# EAGLE design Carranco_shield (EAGLE 6.2)
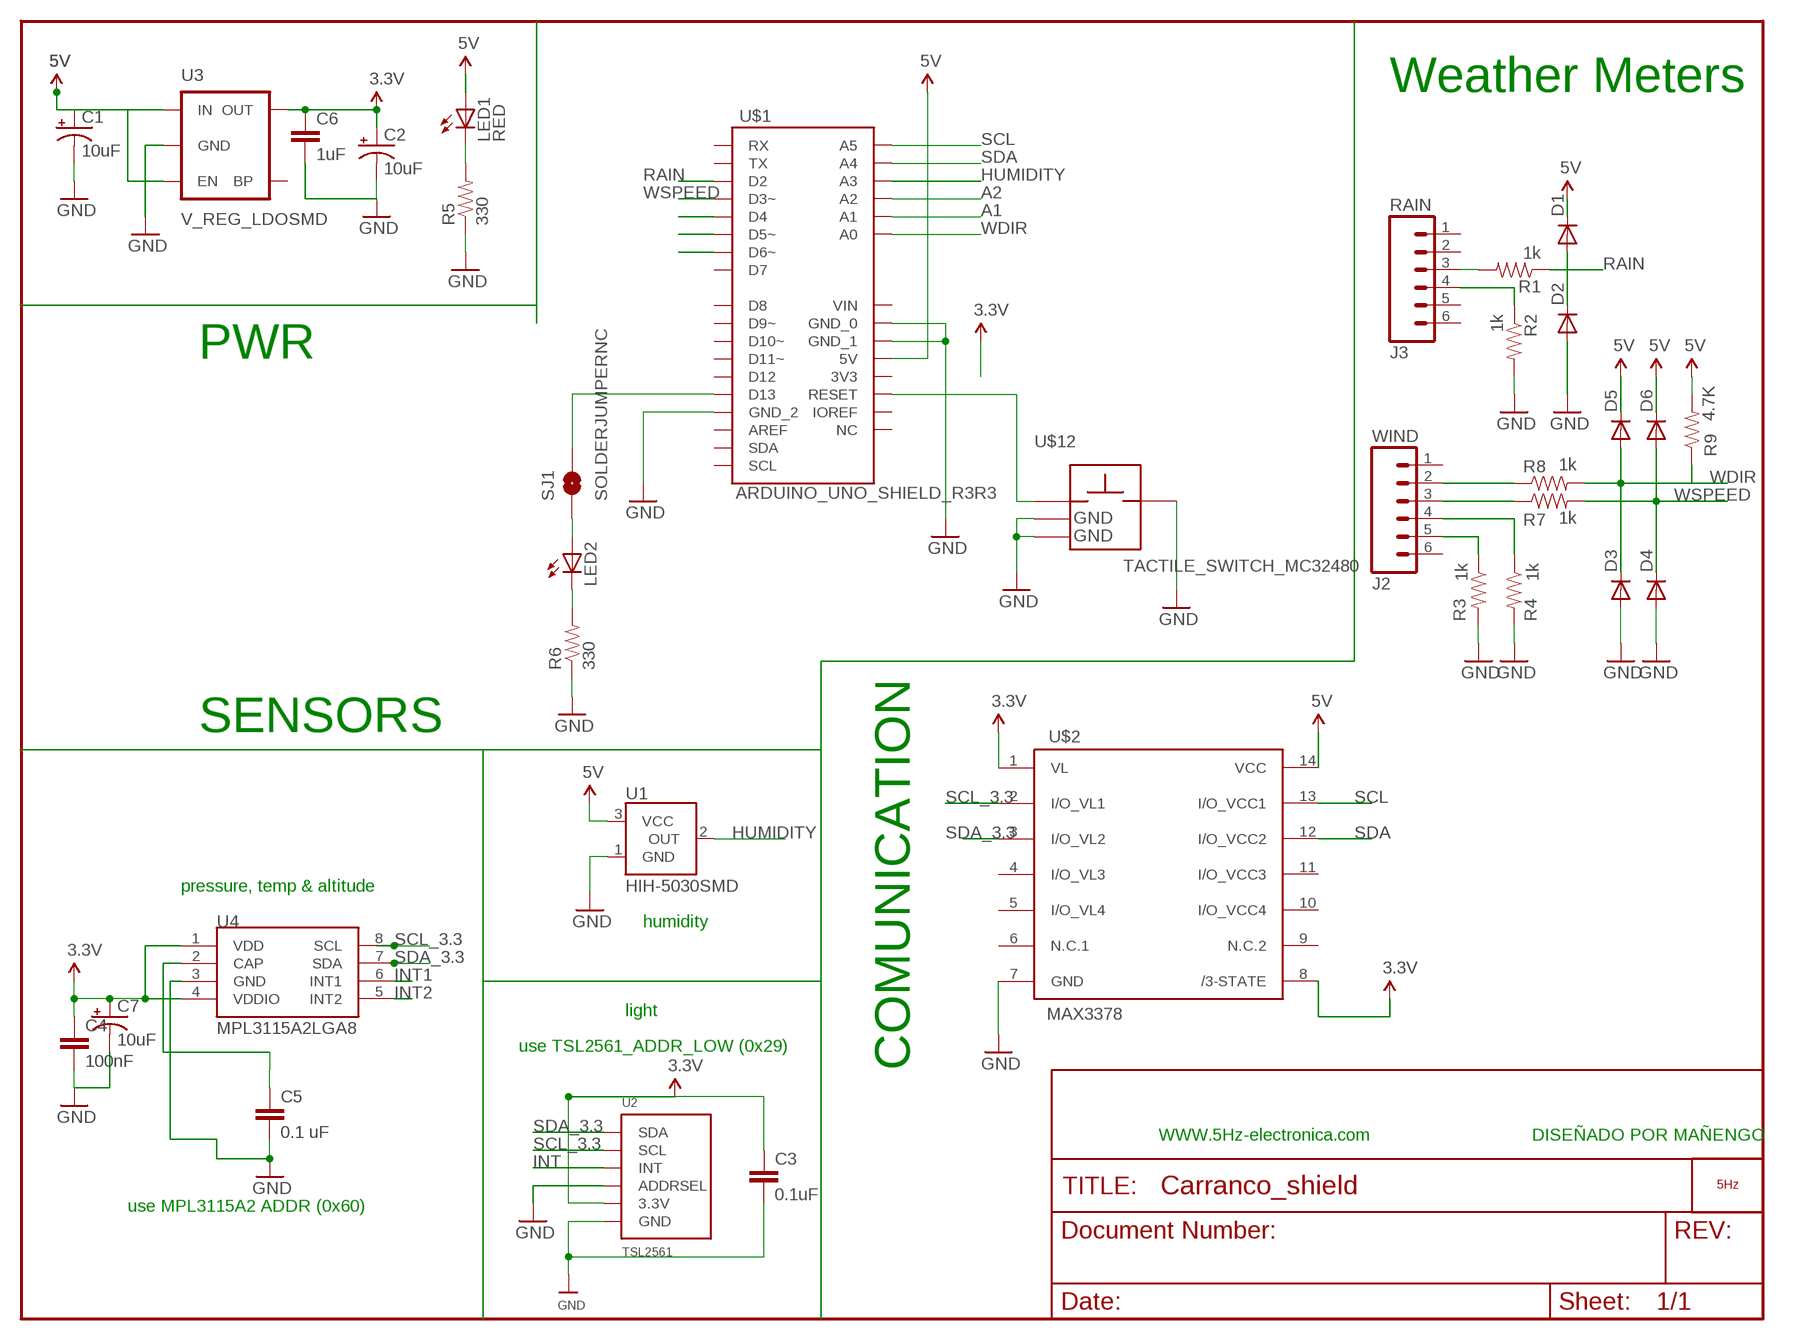
[diagram p0: schematic, sheet 1]

## Parts
C1  10uF  CAP_POL1206  [EIA3216]
C2  10uF  CAP_POL1206  [EIA3216]
C3  0.1uF  CAP0603-CAP  [0603-CAP]
C4  100nF  CAP0603-CAP  [0603-CAP]
C5  0.1 uF  CAP0603-CAP  [0603-CAP]
C6  1uF  CAP0603-CAP  [0603-CAP]
C7  10uF  CAP_POL1206  [EIA3216]
D1  DIODESOD  [SOD-323]
D2  DIODESOD  [SOD-323]
D3  DIODESOD  [SOD-323]
D4  DIODESOD  [SOD-323]
D5  DIODESOD  [SOD-323]
D6  DIODESOD  [SOD-323]
J2  WIND  RJ11-6PTH  [RJ11-6]
J3  RAIN  RJ11-6PTH  [RJ11-6]
LED1  RED  LED0603  [LED-0603]
LED2  LED0603  [LED-0603]
LOGO1  LOGO_5HZ_H_20MM  [5HZ_LOGO_H_20MM]
R1  1k  RESISTOR0603-RES  [0603-RES]
R2  1k  RESISTOR0603-RES  [0603-RES]
R3  1k  RESISTOR0603-RES  [0603-RES]
R4  1k  RESISTOR0603-RES  [0603-RES]
R5  330  RESISTOR0603-RES  [0603-RES]
R6  330  RESISTOR0603-RES  [0603-RES]
R7  1k  RESISTOR0603-RES  [0603-RES]
R8  1k  RESISTOR0603-RES  [0603-RES]
R9  4.7K  RESISTOR0603-RES  [0603-RES]
SJ1  SOLDERJUMPERNC  [SJ_2S]
U1  HIH-5030SMD  [HIH-5030]
U2  TSL2561  [TSL2561_FN]
U3  V_REG_LDOSMD  [SOT23-5]
U4  MPL3115A2LGA8  [LGA8]
U$1  ARDUINO_UNO_SHIELD_R3R3  [UNO_R3_SHIELD_HOLES_NO_SILK]
U$2  MAX3378  [TSSOP14]
U$12  TACTILE_SWITCH_MC32480  [MC32840]

## Nets
3.3V: C2.A(+) C3.1 C4.1 C6.1 C7.A(+) U2.VDD(3.3V) U3.5(OUT) U4.1(VDD) U4.4(VDDIO) U$2.1(VL) U$2.8(/3-STATE)
5V: C1.A(+) D1.1(C) D5.1(C) D6.1(C) LED1.A R9.2 U1.3(VCC) U3.1(IN) U3.3(EN) U$1.5V U$2.14(VCC)
A1: U$1.A1
A2: U$1.A2
GND: C1.C(-) C2.C(-) C3.2 C4.2 C5.2 C6.2 C7.C(-) D2.2(A) D3.2(A) D4.2(A) R2.2 R3.2 R4.2 R5.1 R6.1 U1.1(GND) U2.ADR(ADDRSEL) U2.VSS(GND) U3.2(GND) U4.3(GND) U$1.GND_0 U$1.GND_1 U$1.GND_2 U$2.7(GND) U$12.B U$12.GND@1(GND) U$12.GND@2(GND)
HUMIDITY: U1.2(OUT) U$1.A3
INT: U2.INT
INT1: U4.6(INT1)
INT2: U4.5(INT2)
N$1: U$1.RES(RESET) U$12.A@1(A)
N$2: C5.1 U4.2(CAP)
N$3: J3.3 R1.2
N$5: J3.4 R2.1
N$6: J2.5 R3.1
N$17: J2.4 R4.1
N$34: J2.3 R7.1
N$53: J2.2 R8.1
N$87: U$1.D4
N$88: U$1.D5(D5~)
N$113: U$1.D6(D6~)
N$223: LED2.C R6.2
N$224: LED2.A SJ1.1
N$241: LED1.C R5.2
N$242: SJ1.2 U$1.D13
RAIN: D1.2(A) D2.1(C) R1.1 U$1.D2
SCL: U$1.A5 U$2.13(I/O_VCC1)
SCL_3.3: U2.CLK(SCL) U4.8(SCL) U$2.2(I/O_VL1)
SDA: U$1.A4 U$2.12(I/O_VCC2)
SDA_3.3: U2.DATA(SDA) U4.7(SDA) U$2.3(I/O_VL2)
WDIR: D3.1(C) D5.2(A) R8.2 R9.1 U$1.A0
WSPEED: D4.1(C) D6.2(A) R7.2 U$1.D3(D3~)
Unconnected: J2.1 J2.6 J3.1 J3.2 J3.5 J3.6 U3.4(BP) U$1.3.3V(3V3) U$1.AREF U$1.D7 U$1.D8 U$1.D9(D9~) U$1.D10(D10~) U$1.D11(D11~) U$1.D12 U$1.IOREF U$1.NC U$1.RX U$1.SCL U$1.SDA U$1.TX U$1.VIN U$2.4(I/O_VL3) U$2.5(I/O_VL4) U$2.6(N.C.1) U$2.9(N.C.2) U$2.10(I/O_VCC4) U$2.11(I/O_VCC3)

## Notes on the sheet
- Weather Meters
- PWR
- SENSORS
- pressure, temp & altitude
- humidity
- light
- use TSL2561_ADDR_LOW (0x29)
- COMUNICATION
- WWW.5Hz-electronica.com | DISEÑADO POR MAÑENGO
- use MPL3115A2 ADDR (0x60)

## Library data of the parts
C1 C2 C7 = SparkFun:CAP_POL: Capacitor Polarized These are standard SMD and PTH capacitors. Normally 10uF, 47uF, and 100uF in electrolytic and tantalum varieties. Always verify the external diameter of the through hole cap, it varies with capacity, voltage, and manufacturer. The EIA devices should be standard.
C3-C6 = SparkFun:CAP: Capacitor Standard 0603 ceramic capacitor, and 0.1" leaded capacitor.
D1-D6 = SparkFun:DIODE: Diode These are standard reverse protection diodes and small signal diodes. SMA package can handle up to about 1A. SOD-323 can handle about 200mA. What the SOD-323 package when ordering, there are some mfgs out there that are 5-pin packages.
J2 J3 = SparkFun:RJ11-6: RJ11 Jack Simple 6 pin RJ11 jack. Commonly found on CAT3 devices and Microchip programmers. SKU: PRT-00132
LED1 LED2 = SparkFun:LED: LEDs Standard schematic elements and footprints for 5mm, 3mm, 1206, and 0603 sized LEDs. 5mm - Spark Fun Electronics SKU : COM-00529 (and others)
LOGO1 = 5hz-electronica:LOGO_5HZ: Logotipo 5Hz "según Pedro"
R1-R9 = SparkFun:RESISTOR: Resistor Basic schematic elements and footprints for 0603, 1206, and PTH 1/10th watt (small) resistors.
SJ1 = SparkFun:SOLDERJUMPER: Solder Jumper Standard SMD solder jumper. Used to automate production. Two varients : Normally Open and Normally Closed are the same, but have different paste layers. NC will have a large amount of paste and should jumper during reflow.
U1 = 5hz-electronica:HIH-5030: Humidity Sensor
U2 = microbuilder:TSL2561: TSL2561 Light-To-Digital Sensor Mouser Part Numbers: CS (obsolete): 856-TSL2561CS DFN (cheapest): 856-TSL2561FN
U3 = SparkFun:V_REG_LDO: Voltage Regulator LDO Standard 150mA LDO voltage regulator in SOT-23 layout. Micrel part MIC5205. BP (by-pass) pin is used to lower output noise with 470pF cap.
U4 = SparkFun-Sensors:MPL3115A2: Altimeter/Pressure Sensor, I2C, 1.95V-3.6V supply, 50 to 110kPa
U$1 = 5hz-electronica:ARDUINO_UNO_SHIELD_R3
U$2 = MAÑE:MAX3378
U$12 = PEDRO:TACTILE_SWITCH_MC32480

## Board
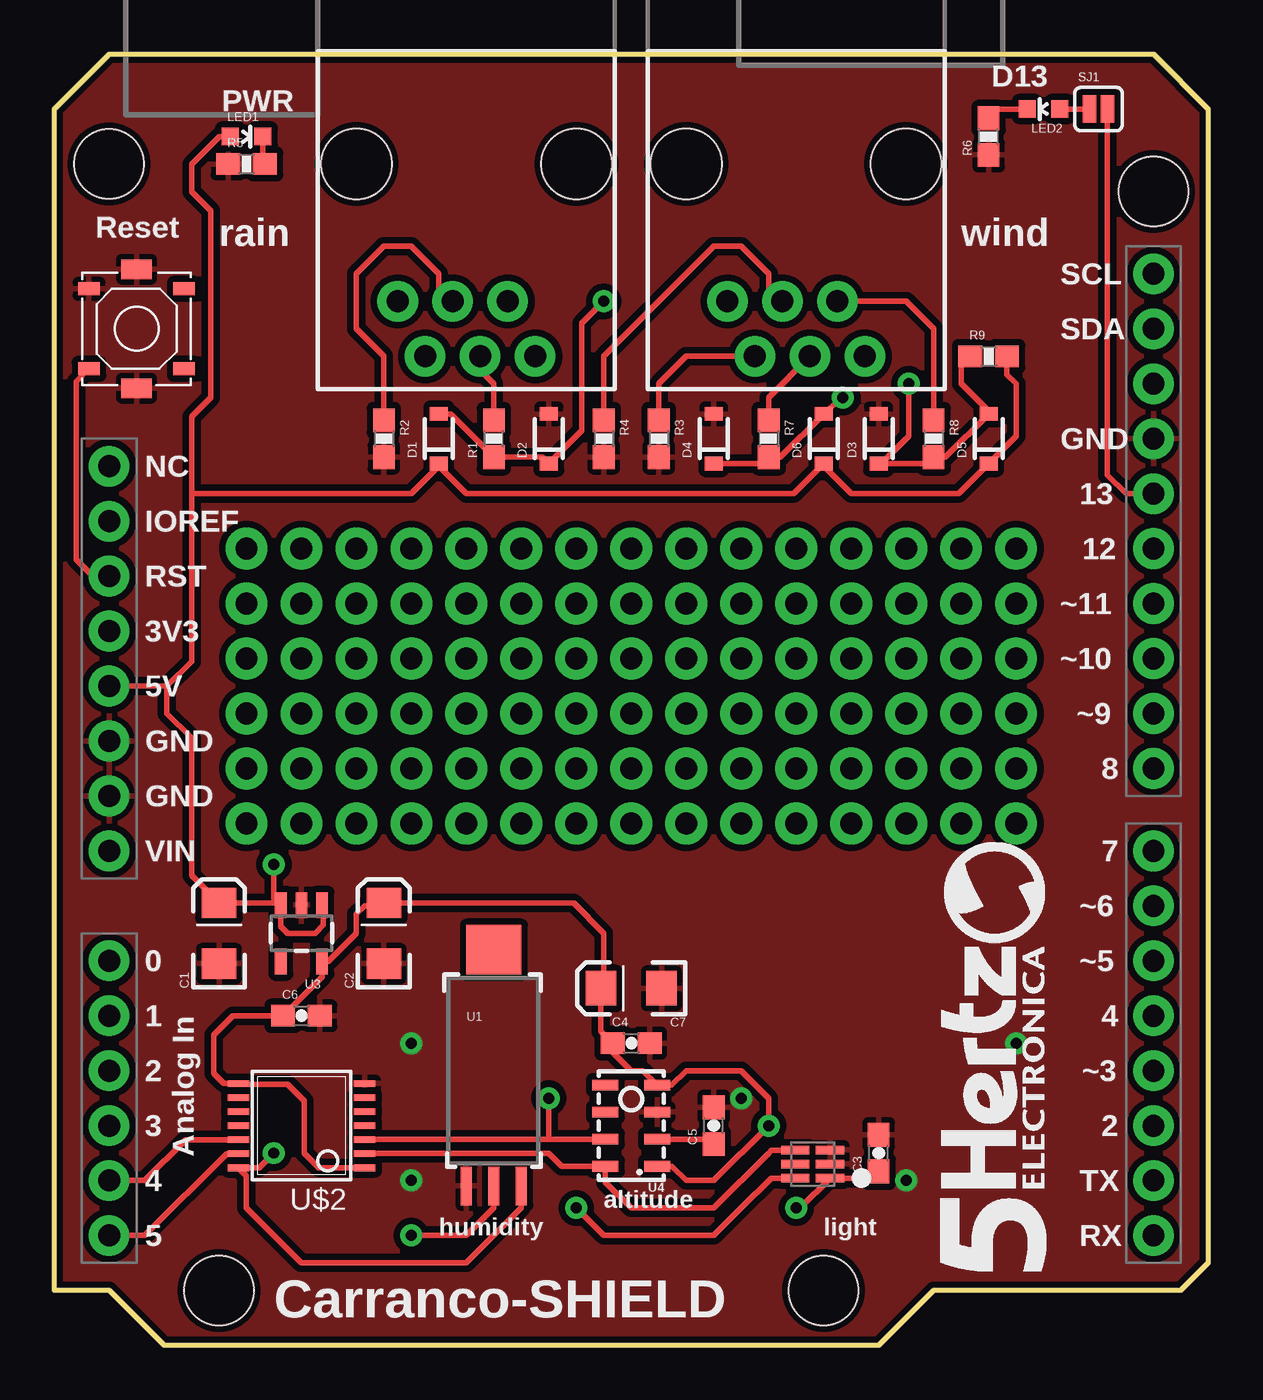
[diagram p1: board, top side]
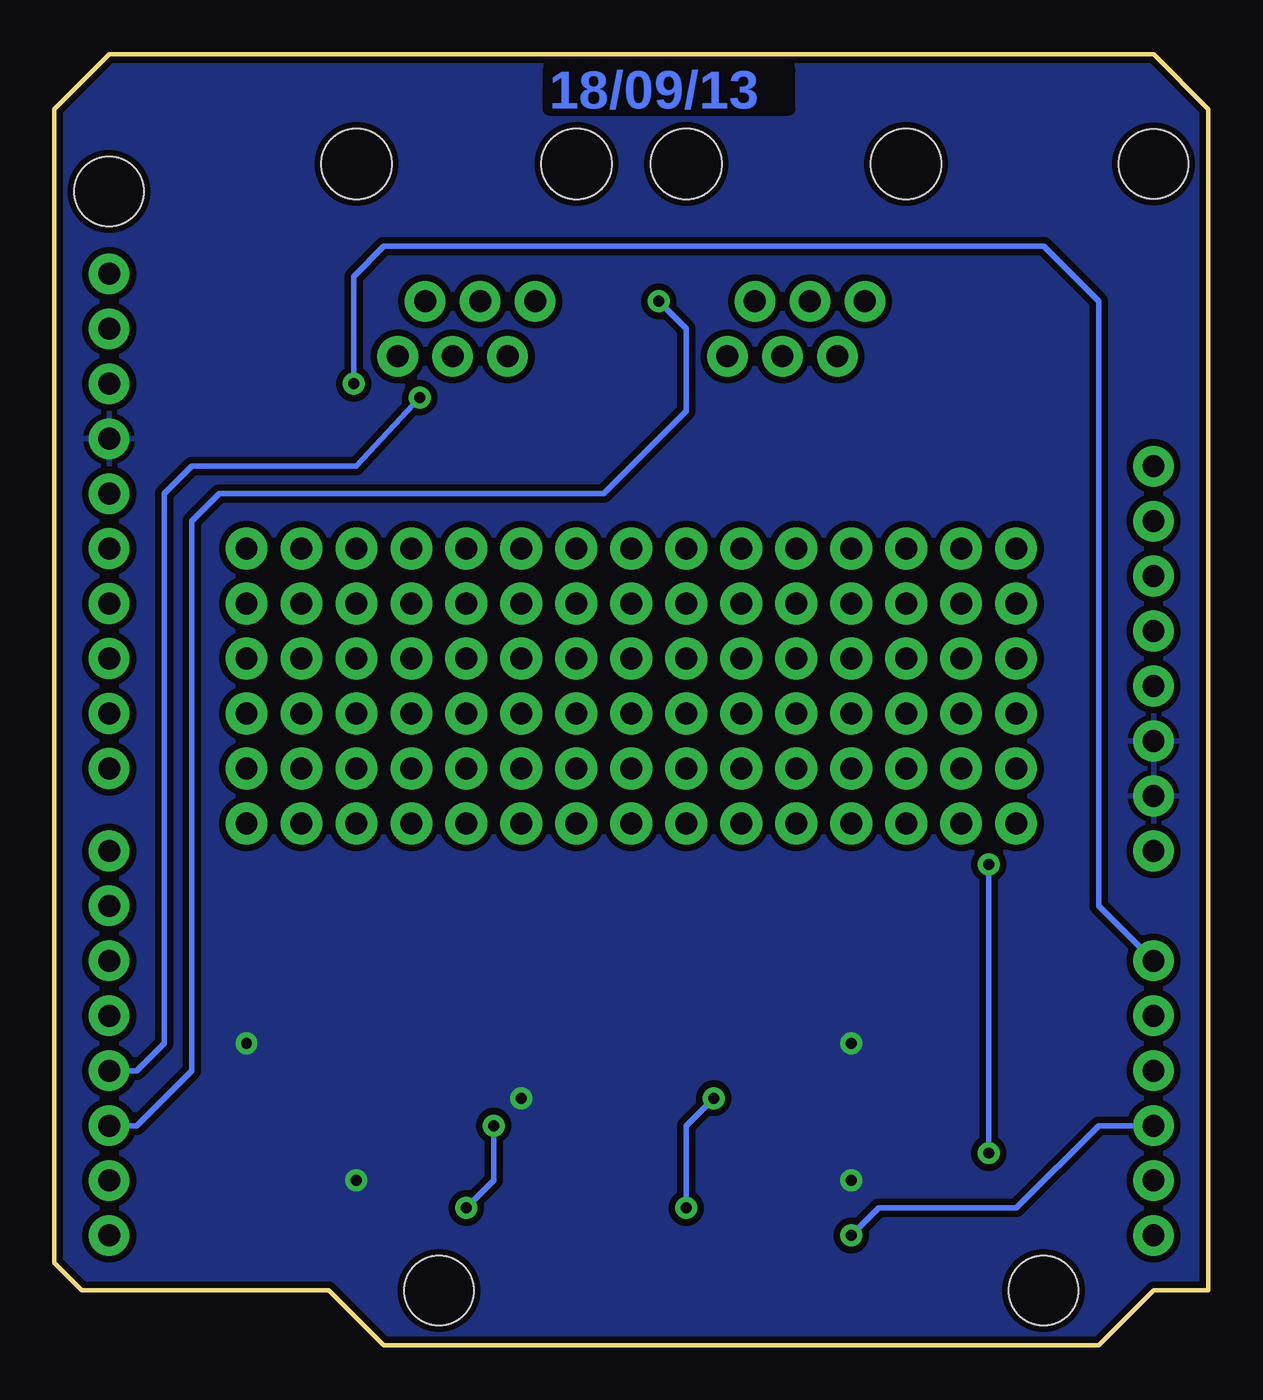
[diagram p2: board, bottom side, seen from below]

Size 53.34 x 59.69 mm. Coordinates in mm from the lower left corner, seen from the top.
Outline: 50.8,59.69 53.34,57.15 53.34,3.81 52.07,2.54 40.64,2.54 38.1,0 5.08,0 2.54,2.54 0,2.54 0,57.15 2.54,59.69 50.8,59.69
Copper layers (1*16): Top 0.035mm / dielectric 1.5mm / Bottom 0.035mm
Design rules: minimum track width 8mil, minimum drill 20mil, track to track 8mil, track to pad 8mil, pad to pad 8mil, via to via 8mil, smd to smd 8mil, copper to edge 10mil, drill to drill 8mil, minimum pad ring 12mil, minimum via ring 10mil, stop-mask expansion 4mil, vias tented up to drill 25mil, thermal gap 10mil

### Footprints (pad centres in the part's own frame; a part is rotated, then mirrored left to right if it is on the bottom)
EIA3216 = smd 1.4 x 1.6: A 1.4,0; C -1.4,0
0603-CAP = smd 1.1 x 1: 1 -0.85,0; 2 0.85,0
SOD-323 = smd 0.63 x 0.83: 1 -1.15,0; 2 1.15,0
RJ11-6 = drill 1.016 pad 1.88: 1 1.905,8.89; 2 3.175,6.35; 3 4.445,8.89; 4 5.715,6.35; 5 6.985,8.89; 6 8.255,6.35 | hole 3.251: 0,0; 10.16,0
LED-0603 = smd 0.8 x 0.8: A 0,-0.75; C 0,0.75
0603-RES = smd 1.1 x 1: 1 -0.85,0; 2 0.85,0
SJ_2S = smd 0.635 x 1.27: 1 -0.412,0; 2 0.412,0
HIH-5030 = smd 0.508 x 1.778: 1 -1.27,-5.08; 2 0,-5.08; 3 1.27,-5.08 | smd 2.54 x 2.286: NC 0,5.842
TSL2561_FN = smd 1.3 x 0.4: ADR -0.8,0; CLK 0.8,-0.65; DATA 0.8,0.65; INT 0.8,0; VDD -0.8,0.65; VSS -0.8,-0.65
SOT23-5 = smd 0.55 x 1.2: 1 -0.95,-1.3; 2 0,-1.3; 3 0.95,-1.3; 4 0.95,1.3; 5 -0.95,1.3
LGA8 = smd 1.2 x 0.5: 1 -1.2,1.875; 2 -1.2,0.625; 3 -1.2,-0.625; 4 -1.2,-1.875; 5 1.2,-1.875; 6 1.2,-0.625; 7 1.2,0.625; 8 1.2,1.875
UNO_R3_SHIELD_HOLES_NO_SILK = drill 1.016 pad 1.88: 3.3V 26.67,2.54; 5V 29.21,2.54; A0 41.91,2.54; A1 44.45,2.54; A2 46.99,2.54; A3 49.53,2.54; A4 52.07,2.54; A5 54.61,2.54; AREF 15.24,50.8; D2 49.53,50.8; D3 46.99,50.8; D4 44.45,50.8; D5 41.91,50.8; D6 39.37,50.8; D7 36.83,50.8; D8 33.02,50.8; D9 30.48,50.8; D10 27.94,50.8; D11 25.4,50.8; D12 22.86,50.8; D13 20.32,50.8; GND_0 34.29,2.54; GND_1 31.75,2.54; GND_2 17.78,50.8; IOREF 21.59,2.54; NC 19.05,2.54; RES 24.13,2.54; RX 54.61,50.8; SCL 10.16,50.8; SDA 12.7,50.8; TX 52.07,50.8; VIN 36.83,2.54 | hole 3.2: 57.15,7.62; 6.35,50.8; 5.08,2.54; 57.15,35.56
TSSOP14 = smd 0.305 x 0.991: 1 -1.95,-2.918; 2 -1.3,-2.918; 3 -0.65,-2.918; 4 0,-2.918; 5 0.65,-2.918; 6 1.3,-2.918; 7 1.95,-2.918; 8 1.95,2.918; 9 1.3,2.918; 10 0.65,2.918; 11 0,2.918; 12 -0.65,2.918; 13 -1.3,2.918; 14 -1.95,2.918
MC32840 = smd 0.6 x 1: A@1 -1.85,2.2; A@2 -1.85,-2.2; B 1.85,2.2; P$5 1.85,-2.2 | smd 0.9 x 1.4: GND@1 -2.75,0; GND@2 2.75,0

### Placement (x,y rotation side)
C1  7.62,19.05 90 top
C2  15.24,19.05 90 top
C3  38.1,8.89 90 top
C4  26.67,13.97 0 top
C5  30.48,10.16 90 top
C6  11.43,15.24 0 top
C7  26.67,16.51 180 top
D1  17.78,41.91 90 top
D2  22.86,41.91 90 top
D3  38.1,41.91 90 top
D4  30.48,41.91 90 top
D5  43.18,41.91 90 top
D6  35.56,41.91 90 top
J2  39.37,54.61 180 top
J3  24.13,54.61 180 top
LED1  8.89,55.88 270 top
LED2  45.72,57.15 90 top
LOGO1  45.85,3.43 90 top
R1  20.32,41.91 90 top
R2  15.24,41.91 270 top
R3  27.94,41.91 270 top
R4  25.4,41.91 270 top
R5  8.89,54.61 0 top
R6  43.18,55.88 90 top
R7  33.02,41.91 270 top
R8  40.64,41.91 270 top
R9  43.18,45.72 0 top
SJ1  48.26,57.15 0 top
U1  20.32,12.45 0 top
U2  35.05,8.38 180 top
U3  11.43,19.05 180 top
U4  26.67,10.16 180 top
U$1  0,59.69 270 top
U$2  11.43,10.16 90 top
U$12  3.81,46.99 90 top

### Tracks (layer width: path | path; a pad name or v marks a point on that pad's centre or on a via)
3.3V  (via drill 0.51)
  Top 0.254: U$2.1 12.24,8.21 11.56,8.89 11.56,11.3 10.79,12.06 8.56,12.06 U$2.8 7.83,12.11 7.37,12.57 7.37,14.35 8.26,15.24 C6.1 12.38,17.04 U3.5 12.67,17.75 13.97,19.05 13.97,19.94 14.35,20.32 15.11,20.32 C2.A 24,20.45 25.4,19.05 25.4,16.64 C7.A 25.27,14.52 C4.1 25.82,13.55 26.67,12.7 27.2,12.7 U4.4 28.55,12.04 29.21,12.7 31.75,12.7 33.02,11.43 v33.02,10.16 30.48,7.62 29.21,7.62 28.55,8.29 U4.1 | C3.1 37.79,7.73 U2.VDD 34.47,6.35 v34.29,6.35
  Bottom 0.254: v33.02,10.16 33.02,7.62 v34.29,6.35
5V  (via drill 0.51)
  Top 0.254: U$1.5V 5.21,30.48 | 5.21,30.48 6.35,31.62 6.35,39.37 | 6.35,39.37 6.35,42.93 7.24,43.81 7.24,52.45 6.35,53.34 6.35,54.61 7.62,55.88 LED1.A | 5.21,30.48 5.21,29.21 6.35,28.07 6.35,21.72 C1.A 10.38,20.45 U3.3 | U3.3 10.48,19.36 10.79,19.05 12.06,19.05 12.45,19.43 12.45,20.28 U3.1 | R9.2 44.03,44.87 44.45,44.45 44.45,42.03 D5.1 41.79,39.37 36.83,39.37 35.56,40.64 D6.1 34.17,39.37 19.05,39.37 17.78,40.64 | 17.78,40.64 D1.1 17.78,40.64 | 17.78,40.64 16.51,39.37 6.35,39.37 | U1.3 21.59,6.35 19.05,3.81 11.43,3.81 8.89,6.35 8.89,7.83 U$2.14 9.48,8.21 v10.16,8.89 | v10.16,22.23 10.16,20.67 U3.3
  Bottom 0.254: v10.16,8.89 v10.16,22.23
GND  (via drill 0.51)
  other vias: 39.37,7.62 44.45,13.97 31.75,11.43 16.51,7.62 16.51,13.97
  pour Top (isolate 0.305): 50.8,59.69 53.34,57.15 53.34,3.81 52.07,2.54 40.64,2.54 38.1,0 5.08,0 2.54,2.54 0,2.54 0,57.15 2.54,59.69
  pour Bottom (isolate 0.305): 50.8,59.69 53.34,57.15 53.34,3.81 52.07,2.54 40.64,2.54 38.1,0 5.08,0 2.54,2.54 0,2.54 0,57.15 2.54,59.69
HUMIDITY  (via drill 0.51)
  Top 0.254: v16.51,5.08 19.05,5.08 20.32,6.35 U1.2
  Bottom 0.254: U$1.A3 5.08,10.16 8.89,6.35 15.24,6.35 v16.51,5.08
N$1
  Top 0.254: U$1.RES 1.78,35.56 1.02,36.32 1.02,44.55 U$12.A@1
N$2
  Top 0.254: U4.2 30.25,9.54 C5.1
N$3
  Top 0.254: J3.3 19.68,45.09 20.32,44.45 R1.2
N$5
  Top 0.254: R2.1 15.24,45.72 13.97,46.99 13.97,49.53 15.24,50.8 16.51,50.8 17.78,49.53 17.78,48.9 J3.4
N$6
  Top 0.254: R3.1 27.94,44.45 29.21,45.72 J2.5
N$11  (via drill 1.02 pad 1.93)
  other vias: 44.45,36.83
N$12  (via drill 1.02 pad 1.93)
  other vias: 44.45,34.29
N$13  (via drill 1.02 pad 1.93)
  other vias: 44.45,31.75
N$14  (via drill 1.02 pad 1.93)
  other vias: 44.45,29.21
N$15  (via drill 1.02 pad 1.93)
  other vias: 44.45,26.67
N$16  (via drill 1.02 pad 1.93)
  other vias: 44.45,24.13
N$17
  Top 0.254: R4.1 25.4,45.72 30.48,50.8 31.75,50.8 33.02,49.53 33.02,48.9 J2.4
N$28  (via drill 1.02 pad 1.93)
  other vias: 41.91,36.83
N$29  (via drill 1.02 pad 1.93)
  other vias: 41.91,34.29
N$30  (via drill 1.02 pad 1.93)
  other vias: 41.91,31.75
N$31  (via drill 1.02 pad 1.93)
  other vias: 41.91,29.21
N$32  (via drill 1.02 pad 1.93)
  other vias: 41.91,26.67
N$33  (via drill 1.02 pad 1.93)
  other vias: 41.91,24.13
N$34
  Top 0.254: R7.1 33.02,43.81 J2.3
N$47  (via drill 1.02 pad 1.93)
  other vias: 39.37,36.83
N$48  (via drill 1.02 pad 1.93)
  other vias: 39.37,34.29
N$49  (via drill 1.02 pad 1.93)
  other vias: 39.37,31.75
N$50  (via drill 1.02 pad 1.93)
  other vias: 39.37,29.21
N$51  (via drill 1.02 pad 1.93)
  other vias: 39.37,26.67
N$52  (via drill 1.02 pad 1.93)
  other vias: 39.37,24.13
N$53
  Top 0.254: R8.1 40.64,46.99 39.37,48.26 J2.2
N$59  (via drill 1.02 pad 1.93)
  other vias: 36.83,24.13
N$60  (via drill 1.02 pad 1.93)
  other vias: 36.83,26.67
N$61  (via drill 1.02 pad 1.93)
  other vias: 36.83,29.21
N$62  (via drill 1.02 pad 1.93)
  other vias: 36.83,31.75
N$63  (via drill 1.02 pad 1.93)
  other vias: 36.83,34.29
N$64  (via drill 1.02 pad 1.93)
  other vias: 36.83,36.83
N$77  (via drill 1.02 pad 1.93)
  other vias: 34.29,36.83
N$78  (via drill 1.02 pad 1.93)
  other vias: 34.29,34.29
N$79  (via drill 1.02 pad 1.93)
  other vias: 34.29,31.75
N$80  (via drill 1.02 pad 1.93)
  other vias: 34.29,29.21
N$81  (via drill 1.02 pad 1.93)
  other vias: 34.29,26.67
N$82  (via drill 1.02 pad 1.93)
  other vias: 34.29,24.13
N$89  (via drill 1.02 pad 1.93)
  other vias: 31.75,24.13
N$90  (via drill 1.02 pad 1.93)
  other vias: 31.75,26.67
N$91  (via drill 1.02 pad 1.93)
  other vias: 31.75,29.21
N$92  (via drill 1.02 pad 1.93)
  other vias: 31.75,31.75
N$93  (via drill 1.02 pad 1.93)
  other vias: 31.75,34.29
N$94  (via drill 1.02 pad 1.93)
  other vias: 31.75,36.83
N$107  (via drill 1.02 pad 1.93)
  other vias: 29.21,36.83
N$108  (via drill 1.02 pad 1.93)
  other vias: 29.21,34.29
N$109  (via drill 1.02 pad 1.93)
  other vias: 29.21,31.75
N$110  (via drill 1.02 pad 1.93)
  other vias: 29.21,29.21
N$111  (via drill 1.02 pad 1.93)
  other vias: 29.21,26.67
N$112  (via drill 1.02 pad 1.93)
  other vias: 29.21,24.13
N$117  (via drill 1.02 pad 1.93)
  other vias: 26.67,24.13
N$118  (via drill 1.02 pad 1.93)
  other vias: 26.67,26.67
N$119  (via drill 1.02 pad 1.93)
  other vias: 26.67,29.21
N$120  (via drill 1.02 pad 1.93)
  other vias: 26.67,31.75
N$121  (via drill 1.02 pad 1.93)
  other vias: 26.67,34.29
N$122  (via drill 1.02 pad 1.93)
  other vias: 26.67,36.83
N$134  (via drill 1.02 pad 1.93)
  other vias: 24.13,36.83
N$135  (via drill 1.02 pad 1.93)
  other vias: 24.13,34.29
N$136  (via drill 1.02 pad 1.93)
  other vias: 24.13,31.75
N$137  (via drill 1.02 pad 1.93)
  other vias: 24.13,29.21
N$138  (via drill 1.02 pad 1.93)
  other vias: 24.13,26.67
N$139  (via drill 1.02 pad 1.93)
  other vias: 24.13,24.13
N$148  (via drill 1.02 pad 1.93)
  other vias: 16.51,24.13
N$149  (via drill 1.02 pad 1.93)
  other vias: 16.51,26.67
N$150  (via drill 1.02 pad 1.93)
  other vias: 13.97,26.67
N$151  (via drill 1.02 pad 1.93)
  other vias: 11.43,26.67
N$152  (via drill 1.02 pad 1.93)
  other vias: 8.89,26.67
N$153  (via drill 1.02 pad 1.93)
  other vias: 13.97,24.13
N$154  (via drill 1.02 pad 1.93)
  other vias: 11.43,24.13
N$155  (via drill 1.02 pad 1.93)
  other vias: 8.89,24.13
N$157  (via drill 1.02 pad 1.93)
  other vias: 8.89,29.21
N$158  (via drill 1.02 pad 1.93)
  other vias: 11.43,29.21
N$159  (via drill 1.02 pad 1.93)
  other vias: 13.97,29.21
N$160  (via drill 1.02 pad 1.93)
  other vias: 16.51,29.21
N$161  (via drill 1.02 pad 1.93)
  other vias: 19.05,29.21
N$162  (via drill 1.02 pad 1.93)
  other vias: 21.59,29.21
N$163  (via drill 1.02 pad 1.93)
  other vias: 21.59,26.67
N$164  (via drill 1.02 pad 1.93)
  other vias: 21.59,24.13
N$169  (via drill 1.02 pad 1.93)
  other vias: 19.05,24.13
N$170  (via drill 1.02 pad 1.93)
  other vias: 19.05,26.67
N$171  (via drill 1.02 pad 1.93)
  other vias: 21.59,31.75
N$172  (via drill 1.02 pad 1.93)
  other vias: 19.05,31.75
N$173  (via drill 1.02 pad 1.93)
  other vias: 16.51,31.75
N$174  (via drill 1.02 pad 1.93)
  other vias: 13.97,31.75
N$175  (via drill 1.02 pad 1.93)
  other vias: 11.43,31.75
N$176  (via drill 1.02 pad 1.93)
  other vias: 8.89,31.75
N$177  (via drill 1.02 pad 1.93)
  other vias: 8.89,34.29
N$178  (via drill 1.02 pad 1.93)
  other vias: 11.43,34.29
N$179  (via drill 1.02 pad 1.93)
  other vias: 13.97,34.29
N$180  (via drill 1.02 pad 1.93)
  other vias: 16.51,34.29
N$181  (via drill 1.02 pad 1.93)
  other vias: 19.05,34.29
N$182  (via drill 1.02 pad 1.93)
  other vias: 21.59,34.29
N$183  (via drill 1.02 pad 1.93)
  other vias: 21.59,36.83
N$194  (via drill 1.02 pad 1.93)
  other vias: 19.05,36.83
N$195  (via drill 1.02 pad 1.93)
  other vias: 16.51,36.83
N$196  (via drill 1.02 pad 1.93)
  other vias: 13.97,36.83
N$197  (via drill 1.02 pad 1.93)
  other vias: 11.43,36.83
N$198  (via drill 1.02 pad 1.93)
  other vias: 8.89,36.83
N$223
  Top 0.254: LED2.C 43.6,57.15 R6.2
N$224
  Top 0.254: LED2.A SJ1.1
N$241
  Top 0.254: LED1.C 9.64,54.71 R5.2
N$242
  Top 0.254: SJ1.2 48.67,40.23 49.53,39.37 U$1.D13
RAIN  (via drill 0.51)
  Top 0.254: D1.2 18.32,43.06 R1.1 22.56,41.06 D2.1 24.38,42.28 24.38,47.24 v25.4,48.26
  Bottom 0.254: U$1.D2 49.53,10.16 46.99,12.7 46.99,38.1 45.72,39.37 27.94,39.37 24.13,43.18 24.13,44.45 24.13,46.99 v25.4,48.26
SCL
  Top 0.254: U$2.13 7.97,8.86 4.19,5.08 U$1.A5
SCL_3.3
  Top 0.254: U$2.2 14.38,8.89 22.86,8.89 23.46,8.29 U4.8 25.47,7.55 26.67,6.35 30.48,6.35 33.02,8.89 33.15,9.02 34.24,9.02 U2.CLK
SDA
  Top 0.254: U$2.12 6.08,9.51 4.19,7.62 U$1.A4
SDA_3.3  (via drill 0.51)
  Top 0.254: U4.7 22.86,9.54 | 22.86,9.54 14.37,9.54 U$2.3 | U2.DATA 33.13,7.73 31.75,6.35 30.48,5.08 25.4,5.08 v24.13,6.35 | v22.86,11.43 22.86,9.54
  Bottom 0.254: v24.13,6.35 24.13,10.16 v22.86,11.43
WDIR  (via drill 0.51)
  Top 0.254: R9.1 41.91,45.3 41.91,44.45 43.18,43.18 D5.2 41.18,41.06 R8.2 40.34,40.76 38.22,40.76 | 38.22,40.76 D3.1 38.22,40.76 | 38.22,40.76 39.5,42.04 v39.5,44.45
  Bottom 0.254: v39.5,44.45 39.5,49.4 38.1,50.8 7.62,50.8 5.08,48.26 5.08,20.32 U$1.A0
WSPEED  (via drill 0.51)
  Top 0.254: D4.1 32.72,40.76 R7.2 33.56,41.06 D6.2 35.68,43.18 v36.45,43.81
  Bottom 0.254: v36.45,43.81 39.37,40.64 46.99,40.64 48.26,39.37 48.26,13.97 49.53,12.7 U$1.D3

### Text on the board
Bottom: 18/09/13
tPlace: D13 | PWR | Reset | rain | wind | SCL | SDA | GND | NC | 13 | IOREF | 12 | RST | ~11 | 3V3 | ~10 | 5V | ~9 | GND | 8 | GND | VIN | 7 | ~6 | 0 | ~5 | 1 | Analog In | 4 | 2 | ~3 | 3 | 2 | 4 | TX | altitude | 5 | humidity | light | RX | Carranco-SHIELD